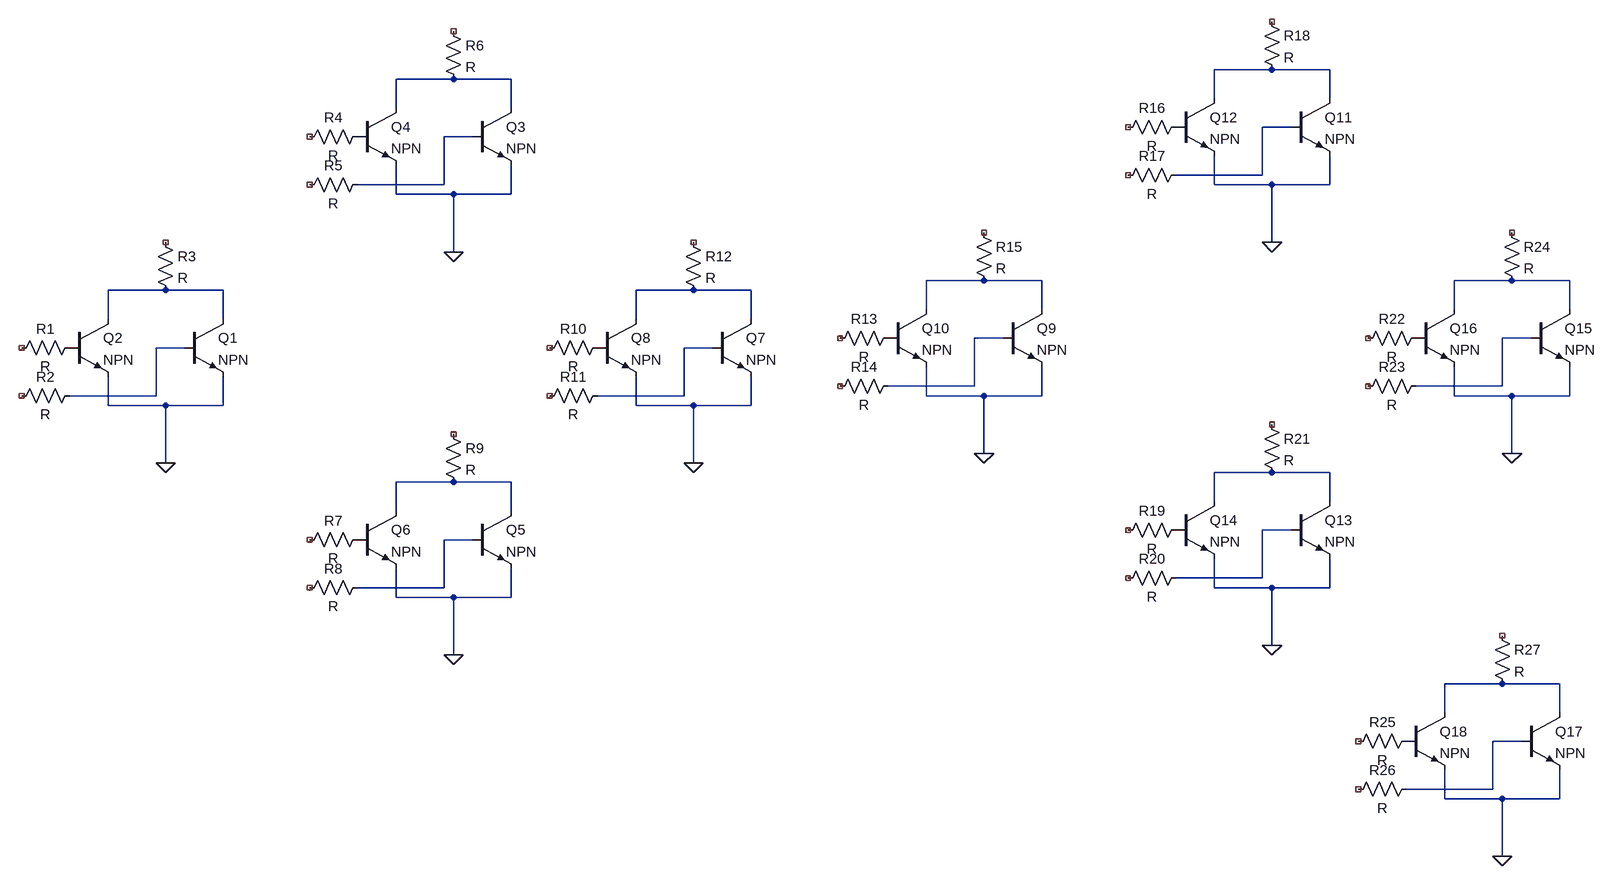
[diagram p0: schematic Draft1.asc]
Draft1.asc, the LTspice schematic file:
Version 4
SHEET 1 2292 1044
WIRE 1744 -288 1648 -288
WIRE 1840 -288 1744 -288
WIRE -544 -272 -640 -272
WIRE -448 -272 -544 -272
WIRE 1648 -240 1648 -288
WIRE 1840 -240 1840 -288
WIRE -640 -224 -640 -272
WIRE -448 -224 -448 -272
WIRE 1776 -192 1728 -192
WIRE -512 -176 -560 -176
WIRE 1728 -112 1728 -192
WIRE 1728 -112 1584 -112
WIRE -560 -96 -560 -176
WIRE -560 -96 -704 -96
WIRE 1648 -96 1648 -144
WIRE 1744 -96 1648 -96
WIRE 1840 -96 1840 -144
WIRE 1840 -96 1744 -96
WIRE -640 -80 -640 -128
WIRE -544 -80 -640 -80
WIRE -448 -80 -448 -128
WIRE -448 -80 -544 -80
WIRE 1744 0 1744 -96
WIRE -544 16 -544 -80
WIRE 1264 64 1168 64
WIRE 1360 64 1264 64
WIRE 2144 64 2048 64
WIRE 2240 64 2144 64
WIRE -1024 80 -1120 80
WIRE -928 80 -1024 80
WIRE -144 80 -240 80
WIRE -48 80 -144 80
WIRE 1168 112 1168 64
WIRE 1360 112 1360 64
WIRE 2048 112 2048 64
WIRE 2240 112 2240 64
WIRE -1120 128 -1120 80
WIRE -928 128 -928 80
WIRE -240 128 -240 80
WIRE -48 128 -48 80
WIRE 1296 160 1248 160
WIRE 2176 160 2128 160
WIRE -992 176 -1040 176
WIRE -112 176 -160 176
WIRE 1248 240 1248 160
WIRE 1248 240 1104 240
WIRE 2128 240 2128 160
WIRE 2128 240 1984 240
WIRE -1040 256 -1040 176
WIRE -1040 256 -1184 256
WIRE -160 256 -160 176
WIRE -160 256 -304 256
WIRE 1168 256 1168 208
WIRE 1264 256 1168 256
WIRE 1360 256 1360 208
WIRE 1360 256 1264 256
WIRE 2048 256 2048 208
WIRE 2144 256 2048 256
WIRE 2240 256 2240 208
WIRE 2240 256 2144 256
WIRE -1120 272 -1120 224
WIRE -1024 272 -1120 272
WIRE -928 272 -928 224
WIRE -928 272 -1024 272
WIRE -240 272 -240 224
WIRE -144 272 -240 272
WIRE -48 272 -48 224
WIRE -48 272 -144 272
WIRE 1264 352 1264 256
WIRE 2144 352 2144 256
WIRE -1024 368 -1024 272
WIRE -144 368 -144 272
WIRE 1744 384 1648 384
WIRE 1840 384 1744 384
WIRE -544 400 -640 400
WIRE -448 400 -544 400
WIRE 1648 432 1648 384
WIRE 1840 432 1840 384
WIRE -640 448 -640 400
WIRE -448 448 -448 400
WIRE 1776 480 1728 480
WIRE -512 496 -560 496
WIRE 1728 560 1728 480
WIRE 1728 560 1584 560
WIRE -560 576 -560 496
WIRE -560 576 -704 576
WIRE 1648 576 1648 528
WIRE 1744 576 1648 576
WIRE 1840 576 1840 528
WIRE 1840 576 1744 576
WIRE -640 592 -640 544
WIRE -544 592 -640 592
WIRE -448 592 -448 544
WIRE -448 592 -544 592
WIRE 1744 672 1744 576
WIRE -544 688 -544 592
WIRE 2128 736 2032 736
WIRE 2224 736 2128 736
WIRE 2032 784 2032 736
WIRE 2224 784 2224 736
WIRE 2160 832 2112 832
WIRE 2112 912 2112 832
WIRE 2112 912 1968 912
WIRE 2032 928 2032 880
WIRE 2128 928 2032 928
WIRE 2224 928 2224 880
WIRE 2224 928 2128 928
WIRE 2128 1024 2128 928
FLAG -1024 368 0
FLAG -544 16 0
FLAG -544 688 0
FLAG -144 368 0
FLAG 1264 352 0
FLAG 1744 0 0
FLAG 1744 672 0
FLAG 2144 352 0
FLAG 2128 1024 0
SYMBOL npn -992 128 R0
SYMATTR InstName Q1
SYMBOL npn -1184 128 R0
SYMATTR InstName Q2
SYMBOL res -1168 160 R90
WINDOW 0 0 56 VBottom 2
WINDOW 3 32 56 VTop 2
SYMATTR InstName R1
SYMBOL res -1168 240 R90
WINDOW 0 0 56 VBottom 2
WINDOW 3 32 56 VTop 2
SYMATTR InstName R2
SYMBOL res -1040 -16 R0
SYMATTR InstName R3
SYMBOL npn -512 -224 R0
SYMATTR InstName Q3
SYMBOL npn -704 -224 R0
SYMATTR InstName Q4
SYMBOL res -688 -192 R90
WINDOW 0 0 56 VBottom 2
WINDOW 3 32 56 VTop 2
SYMATTR InstName R4
SYMBOL res -688 -112 R90
WINDOW 0 0 56 VBottom 2
WINDOW 3 32 56 VTop 2
SYMATTR InstName R5
SYMBOL res -560 -368 R0
SYMATTR InstName R6
SYMBOL npn -512 448 R0
SYMATTR InstName Q5
SYMBOL npn -704 448 R0
SYMATTR InstName Q6
SYMBOL res -688 480 R90
WINDOW 0 0 56 VBottom 2
WINDOW 3 32 56 VTop 2
SYMATTR InstName R7
SYMBOL res -688 560 R90
WINDOW 0 0 56 VBottom 2
WINDOW 3 32 56 VTop 2
SYMATTR InstName R8
SYMBOL res -560 304 R0
SYMATTR InstName R9
SYMBOL npn -112 128 R0
SYMATTR InstName Q7
SYMBOL npn -304 128 R0
SYMATTR InstName Q8
SYMBOL res -288 160 R90
WINDOW 0 0 56 VBottom 2
WINDOW 3 32 56 VTop 2
SYMATTR InstName R10
SYMBOL res -288 240 R90
WINDOW 0 0 56 VBottom 2
WINDOW 3 32 56 VTop 2
SYMATTR InstName R11
SYMBOL res -160 -16 R0
SYMATTR InstName R12
SYMBOL npn 1296 112 R0
SYMATTR InstName Q9
SYMBOL npn 1104 112 R0
SYMATTR InstName Q10
SYMBOL res 1120 144 R90
WINDOW 0 0 56 VBottom 2
WINDOW 3 32 56 VTop 2
SYMATTR InstName R13
SYMBOL res 1120 224 R90
WINDOW 0 0 56 VBottom 2
WINDOW 3 32 56 VTop 2
SYMATTR InstName R14
SYMBOL res 1248 -32 R0
SYMATTR InstName R15
SYMBOL npn 1776 -240 R0
SYMATTR InstName Q11
SYMBOL npn 1584 -240 R0
SYMATTR InstName Q12
SYMBOL res 1600 -208 R90
WINDOW 0 0 56 VBottom 2
WINDOW 3 32 56 VTop 2
SYMATTR InstName R16
SYMBOL res 1600 -128 R90
WINDOW 0 0 56 VBottom 2
WINDOW 3 32 56 VTop 2
SYMATTR InstName R17
SYMBOL res 1728 -384 R0
SYMATTR InstName R18
SYMBOL npn 1776 432 R0
SYMATTR InstName Q13
SYMBOL npn 1584 432 R0
SYMATTR InstName Q14
SYMBOL res 1600 464 R90
WINDOW 0 0 56 VBottom 2
WINDOW 3 32 56 VTop 2
SYMATTR InstName R19
SYMBOL res 1600 544 R90
WINDOW 0 0 56 VBottom 2
WINDOW 3 32 56 VTop 2
SYMATTR InstName R20
SYMBOL res 1728 288 R0
SYMATTR InstName R21
SYMBOL npn 2176 112 R0
SYMATTR InstName Q15
SYMBOL npn 1984 112 R0
SYMATTR InstName Q16
SYMBOL res 2000 144 R90
WINDOW 0 0 56 VBottom 2
WINDOW 3 32 56 VTop 2
SYMATTR InstName R22
SYMBOL res 2000 224 R90
WINDOW 0 0 56 VBottom 2
WINDOW 3 32 56 VTop 2
SYMATTR InstName R23
SYMBOL res 2128 -32 R0
SYMATTR InstName R24
SYMBOL npn 2160 784 R0
SYMATTR InstName Q17
SYMBOL npn 1968 784 R0
SYMATTR InstName Q18
SYMBOL res 1984 816 R90
WINDOW 0 0 56 VBottom 2
WINDOW 3 32 56 VTop 2
SYMATTR InstName R25
SYMBOL res 1984 896 R90
WINDOW 0 0 56 VBottom 2
WINDOW 3 32 56 VTop 2
SYMATTR InstName R26
SYMBOL res 2112 640 R0
SYMATTR InstName R27

The netlist it stands for:
* Draft1.asc
Q1 N007 N011 0 0 NPN
Q2 N007 P001 0 0 NPN
R1 P001 NC_01 R
R2 N011 NC_02 R
R3 NC_03 N007 R
Q3 N002 N004 0 0 NPN
Q4 N002 P002 0 0 NPN
R4 P002 NC_04 R
R5 N004 NC_05 R
R6 NC_06 N002 R
Q5 N014 N016 0 0 NPN
Q6 N014 P003 0 0 NPN
R7 P003 NC_07 R
R8 N016 NC_08 R
R9 NC_09 N014 R
Q7 N008 N012 0 0 NPN
Q8 N008 P004 0 0 NPN
R10 P004 NC_10 R
R11 N012 NC_11 R
R12 NC_12 N008 R
Q9 N005 N009 0 0 NPN
Q10 N005 P005 0 0 NPN
R13 P005 NC_13 R
R14 N009 NC_14 R
R15 NC_15 N005 R
Q11 N001 N003 0 0 NPN
Q12 N001 P006 0 0 NPN
R16 P006 NC_16 R
R17 N003 NC_17 R
R18 NC_18 N001 R
Q13 N013 N015 0 0 NPN
Q14 N013 P007 0 0 NPN
R19 P007 NC_19 R
R20 N015 NC_20 R
R21 NC_21 N013 R
Q15 N006 N010 0 0 NPN
Q16 N006 P008 0 0 NPN
R22 P008 NC_22 R
R23 N010 NC_23 R
R24 NC_24 N006 R
Q17 N017 N018 0 0 NPN
Q18 N017 P009 0 0 NPN
R25 P009 NC_25 R
R26 N018 NC_26 R
R27 NC_27 N017 R
.model NPN NPN
.model PNP PNP
.lib standard.bjt
.backanno
.end